# Altium project PCB_Project.PrjPcb
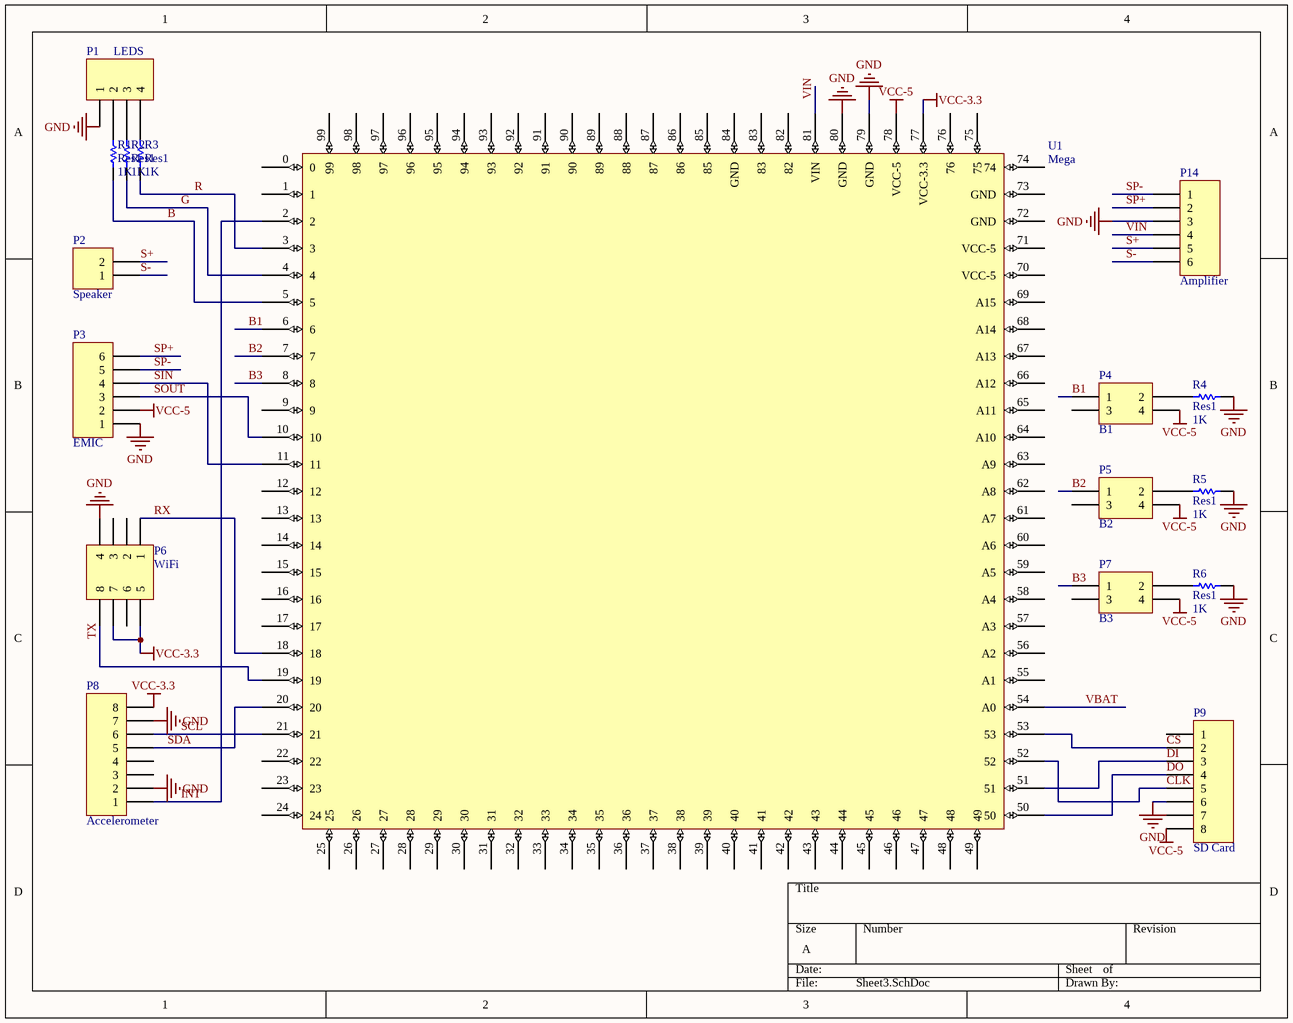
[diagram p0: Sheet3.SchDoc]
2 sheets, 21 parts. Net scope: global (net labels, ports and power ports of the same name join across sheets).
Board file: PCB1.PcbDoc
Sheets:
  Sheet3.SchDoc
  Sheet4.SchDoc

## Sheet Sheet3.SchDoc
size A

### Parts
P1  LEDS  [HDR1X4]
P2  Speaker  [HDR1X2]
P3  EMIC  [EMIC]
P4  B1  [HDR2X2]
P5  B2  [HDR2X2]
P6  WiFi  [WiFi]
P7  B3  [HDR2X2]
P8  Accelerometer  [Acceelrometer]
P9  SD Card  [SD Card]
P14  Amplifier  [HDR1X6]
R1  Res1  value 1K  [14-1210]
R2  Res1  value 1K  [14-1210]
R3  Res1  value 1K  [14-1210]
R4  Res1  value 1K  [14-1210]
R5  Res1  value 1K  [14-1210]
R6  Res1  value 1K  [14-1210]
U1  Mega  [Mega]

### Nets
GND: P1.1 P3.1 P6.4 P8.2 P8.7 P9.6 P14.3 R4.2 R5.2 R6.2 U1.79(GND) U1.80(GND)
VCC-3.3: P6.5 P6.7 P8.8 U1.77(VCC-3.3)
VCC-5: P3.2 P4.4 P5.4 P7.4 P9.8 U1.78(VCC-5)
B: R1.1 U1.5
B1: P4.1 U1.6
B2: P5.1 U1.7
B3: P7.1 U1.8
CLK: P9.5 U1.52
CS: P9.2 U1.53
DI: P9.3 U1.51
DO: P9.4 U1.50
G: R2.1 U1.4
INT: P8.1 U1.2
R: R3.1 U1.3
RX: P6.1 U1.18
S+: P2.2 P14.5
S-: P2.1 P14.6
SCL: P8.6 U1.21
SDA: P8.5 U1.20
SIN: P3.4 U1.11
SOUT: P3.3 U1.10
SP+: P3.6 P14.2
SP-: P3.5 P14.1
TX: P6.8 U1.19
VBAT: U1.54(A0)
VIN: P14.4 U1.81(VIN)
NetP1_2: P1.2 R1.2
NetP1_3: P1.3 R2.2
NetP1_4: P1.4 R3.2
NetP4_2: P4.2 R4.1
NetP5_2: P5.2 R5.1
NetP7_2: P7.2 R6.1

Not connected (* = marked no-connect by the designer): P4 3; P5 3; P6 2 3 6; P7 3; P8 3 4; P9 1 7; U1 0 1 9 12 13 14 15 16 17 22 23 24 25 26 27 28 29 30 31 32 33 34 35 36 37 38 39 40 41 42 43 44 45 46 47 48 49 55(A1) 56(A2) 57(A3) 58(A4) 59(A5) 60(A6) 61(A7) 62(A8) 63(A9) 64(A10) 65(A11) 66(A12) 67(A13) 68(A14) 69(A15) 70(VCC-5) 71(VCC-5) 72(GND) 73(GND) 74 75 76 82 83 84(GND) 85 86 87 88 89 90 91 92 93 94 95 96 97 98 99

### Library data of the parts
P1 = Header 4: Header, 4-Pin; LatestRevisionDate: 17-Jul-2002; LatestRevisionNote: Re-released for DXP Platform.; Publisher: Altium Limited
P2 = Header 2: Header, 2-Pin; LatestRevisionDate: 17-Jul-2002; LatestRevisionNote: Re-released for DXP Platform.; Publisher: Altium Limited
P3 P14 = Header 6: Header, 6-Pin; LatestRevisionDate: 17-Jul-2002; LatestRevisionNote: Re-released for DXP Platform.; Publisher: Altium Limited
P4 P5 P7 = Header 2X2: Header, 2-Pin, Dual row; LatestRevisionDate: 17-Jul-2002; LatestRevisionNote: Re-released for DXP Platform.; Publisher: Altium Limited
P6 = Header 4X2A: Header, 4-Pin, Dual row; LatestRevisionDate: 17-Jul-2002; LatestRevisionNote: Re-released for DXP Platform.; Publisher: Altium Limited
P8 P9 = Header 8: Header, 8-Pin; LatestRevisionDate: 17-Jul-2002; LatestRevisionNote: Re-released for DXP Platform.; Publisher: Altium Limited
R1-R6 = Res1: Resistor; Published: 8-Jun-2000; LatestRevisionDate: 17-Jul-2002; LatestRevisionNote: Re-released for DXP Platform.; PackageReference: AXIAL-0.3; Publisher: Altium Limited; PackageDescription: Axial Device, Thru-Hole; 2 Leads; 0.3 in Pin Spacing

## Sheet Sheet4.SchDoc
size A
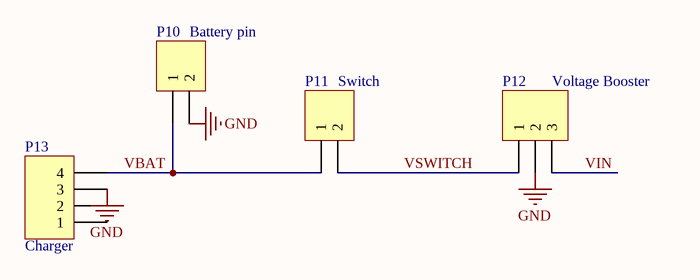
[diagram p1: Sheet4.SchDoc]

### Parts
P10  Battery pin  [HDR1X2]
P11  Switch  [HDR1X2]
P12  Voltage Booster  [Voltage Regulator]
P13  Charger  [HDR1X4]

### Nets
GND: P10.2 P12.2 P13.3
VBAT: P10.1 P11.1 P13.4
VIN: P12.3
VSWITCH: P11.2 P12.1

Not connected (* = marked no-connect by the designer): P13 1 2

### Library data of the parts
P10 P11 = Header 2: Header, 2-Pin; LatestRevisionDate: 17-Jul-2002; LatestRevisionNote: Re-released for DXP Platform.; Publisher: Altium Limited
P12 = Header 3: Header, 3-Pin; LatestRevisionDate: 17-Jul-2002; LatestRevisionNote: Re-released for DXP Platform.; Publisher: Altium Limited
P13 = Header 4: Header, 4-Pin; LatestRevisionDate: 17-Jul-2002; LatestRevisionNote: Re-released for DXP Platform.; Publisher: Altium Limited

## Nets that join several sheets
GND: Sheet3 (12 pins), Sheet4 (P10.2 P12.2 P13.3)
VBAT: Sheet3 (U1.54), Sheet4 (P10.1 P11.1 P13.4)
VIN: Sheet3 (P14.4 U1.81), Sheet4 (P12.3)